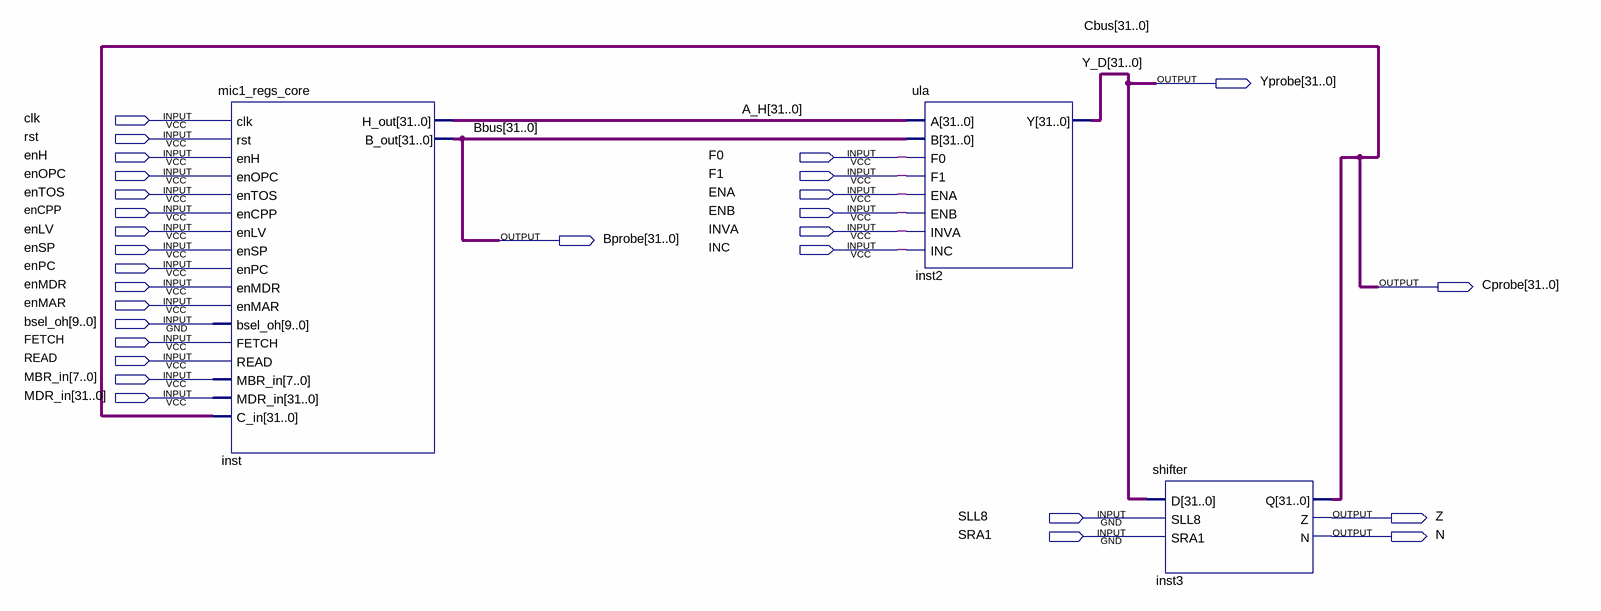
[diagram p0: schematic sheet]
// Quartus schematic mic1_draw.bdf as structural Verilog: 3 symbols, 29 pins
module mic1_draw (
  input  clk,
  input  rst,
  input  enH,
  input  F0,
  input  enOPC,
  input  F1,
  input  enTOS,
  input  ENA,
  input  enCPP,
  input  ENB,
  input  enLV,
  input  INVA,
  input  enSP,
  input  INC,
  input  enPC,
  input  enMDR,
  input  enMAR,
  input  [9:0] bsel_oh,
  input  FETCH,
  input  READ,
  input  [7:0] MBR_in,
  input  [31:0] MDR_in,
  input  SLL8,
  input  SRA1,
  output [31:0] Yprobe,
  output [31:0] Bprobe,
  output [31:0] Cprobe,
  output Z,
  output N
);

  wire [31:0] A_H;

  mic1_regs_core inst (
    .clk(clk), .rst(rst), .enH(enH), .enOPC(enOPC), .enTOS(enTOS), .enCPP(enCPP), .enLV(enLV), .enSP(enSP),
    .enPC(enPC), .enMDR(enMDR), .enMAR(enMAR), .bsel_oh(bsel_oh), .FETCH(FETCH), .READ(READ),
    .MBR_in(MBR_in), .MDR_in(MDR_in), .C_in(Cprobe), .H_out(A_H), .B_out(Bprobe));
  ula inst2 (.A(A_H), .B(Bprobe), .F0(F0), .F1(F1), .ENA(ENA), .ENB(ENB), .INVA(INVA), .INC(INC), .Y(Yprobe));
  shifter inst3 (.D(Yprobe), .SLL8(SLL8), .SRA1(SRA1), .Q(Cprobe), .Z(Z), .N(N));

  // Other names for the same wires on the sheet: Bbus[31:0] = Bprobe; Cbus[31:0] = Cprobe; Y_D[31:0] = Yprobe
endmodule
